# Altium project APP_1_huom2704.PrjPcb (part 2 of 2)

## Sheet APP_1_PowerAnalog.SchDoc
size Tabloid; SheetNumber: 15; SheetTotal: 16; Sheet_Name: Power; Size: 11x17
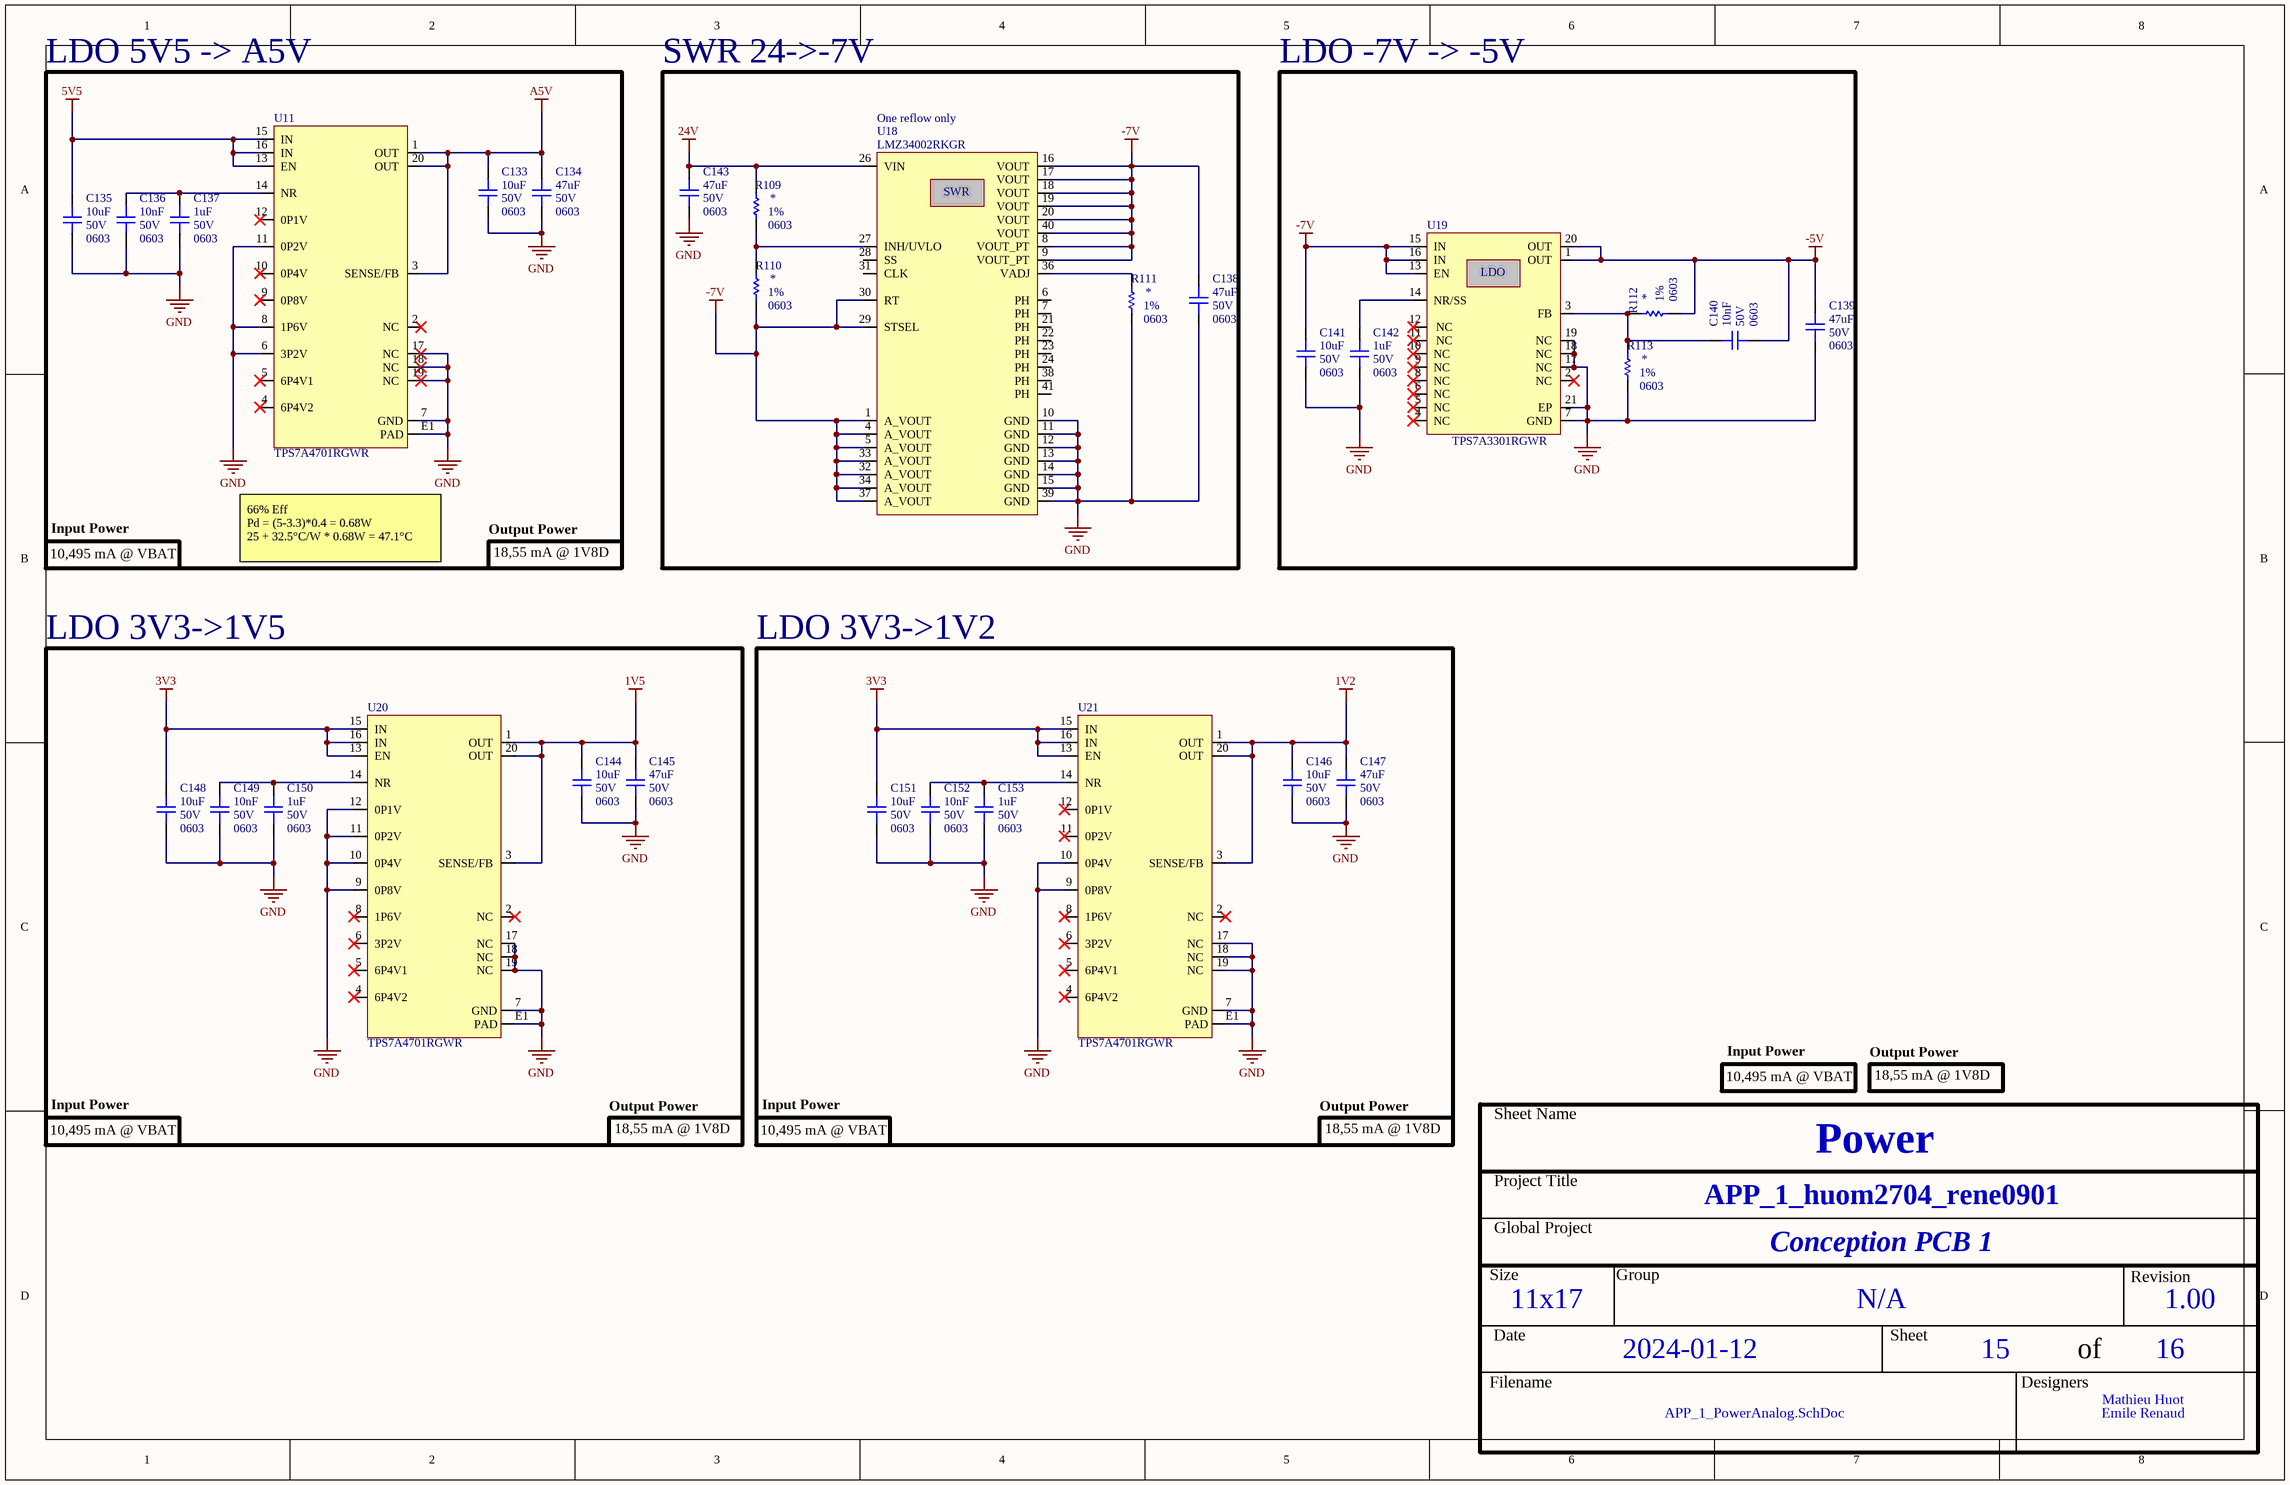
[diagram p7: APP_1_PowerAnalog.SchDoc]

### Parts
C133  value 10uF  Voltage: 50V  Package: 0603  [CAP_0603]  (hidden comment: CAP - 0603)
C134  value 47uF  Voltage: 50V  Package: 0603  [CAP_0603]  (hidden comment: CAP - 0603)
C135  value 10uF  Voltage: 50V  Package: 0603  [CAP_0603]  (hidden comment: CAP - 0603)
C136  value 10nF  Voltage: 50V  Package: 0603  [CAP_0603]  (hidden comment: CAP - 0603)
C137  value 1uF  Voltage: 50V  Package: 0603  [CAP_0603]  (hidden comment: CAP - 0603)
C138  value 47uF  Voltage: 50V  Package: 0603  [CAP_0603]  (hidden comment: CAP - 0603)
C139  value 47uF  Voltage: 50V  Package: 0603  [CAP_0603]  (hidden comment: CAP - 0603)
C140  value 10nF  Voltage: 50V  Package: 0603  [CAP_0603]  (hidden comment: CAP - 0603)
C141  value 10uF  Voltage: 50V  Package: 0603  [CAP_0603]  (hidden comment: CAP - 0603)
C142  value 1uF  Voltage: 50V  Package: 0603  [CAP_0603]  (hidden comment: CAP - 0603)
C143  value 47uF  Voltage: 50V  Package: 0603  [CAP_0603]  (hidden comment: CAP - 0603)
C144  value 10uF  Voltage: 50V  Package: 0603  [CAP_0603]  (hidden comment: CAP - 0603)
C145  value 47uF  Voltage: 50V  Package: 0603  [CAP_0603]  (hidden comment: CAP - 0603)
C146  value 10uF  Voltage: 50V  Package: 0603  [CAP_0603]  (hidden comment: CAP - 0603)
C147  value 47uF  Voltage: 50V  Package: 0603  [CAP_0603]  (hidden comment: CAP - 0603)
C148  value 10uF  Voltage: 50V  Package: 0603  [CAP_0603]  (hidden comment: CAP - 0603)
C149  value 10nF  Voltage: 50V  Package: 0603  [CAP_0603]  (hidden comment: CAP - 0603)
C150  value 1uF  Voltage: 50V  Package: 0603  [CAP_0603]  (hidden comment: CAP - 0603)
C151  value 10uF  Voltage: 50V  Package: 0603  [CAP_0603]  (hidden comment: CAP - 0603)
C152  value 10nF  Voltage: 50V  Package: 0603  [CAP_0603]  (hidden comment: CAP - 0603)
C153  value 1uF  Voltage: 50V  Package: 0603  [CAP_0603]  (hidden comment: CAP - 0603)
R109  Package: 0603  Precision: 1%  [RES_0603]  (hidden comment: RES - 0603)
R110  Package: 0603  Precision: 1%  [RES_0603]  (hidden comment: RES - 0603)
R111  Package: 0603  Precision: 1%  [RES_0603]  (hidden comment: RES - 0603)
R112  Package: 0603  Precision: 1%  [RES_0603]  (hidden comment: RES - 0603)
R113  Package: 0603  Precision: 1%  [RES_0603]  (hidden comment: RES - 0603)
U11  TPS7A4701RGWR  [REG_TPS7A4701RGWR]
U18  LMZ34002RKGR  Assembly Note: One reflow only  [REG_SWR_LMZ34002RKGR]
U19  TPS7A3301RGWR  [REG_LDO_TPS7A3301RGWR]
U20  TPS7A4701RGWR  [REG_TPS7A4701RGWR]
U21  TPS7A4701RGWR  [REG_TPS7A4701RGWR]

### Blocks framed on the sheet
LDO 5V5 -> A5V: C133-C137 U11
SWR 24->-7V: C138 C143 R109-R111 U18
LDO -7V -> -5V: C139-C142 R112 R113 U19
LDO 3V3->1V5: C144 C145 C148-C150 U20
LDO 3V3->1V2: C146 C147 C151-C153 U21

### Nets
1V2: C146.2 C147.2 U21.1(OUT) U21.3(SENSE/FB) U21.20(OUT)
1V5: C144.2 C145.2 U20.1(OUT) U20.3(SENSE/FB) U20.20(OUT)
3V3: C148.2 C151.2 U20.13(EN) U20.15(IN) U20.16(IN) U21.13(EN) U21.15(IN) U21.16(IN)
5V5: C135.2 U11.13(EN) U11.15(IN) U11.16(IN)
24V: C143.2 R109.2 U18.26(VIN)
-5V: C139.2 C140.1 R112.1 U19.1(OUT) U19.20(OUT)
-7V: C138.2 C141.2 R110.1 U18.1(A_VOUT) U18.4(A_VOUT) U18.5(A_VOUT) U18.8(VOUT_PT) U18.9(VOUT_PT) U18.16(VOUT) U18.17(VOUT) U18.18(VOUT) U18.19(VOUT) U18.20(VOUT) U18.29(STSEL) U18.30(RT) U18.32(A_VOUT) U18.33(A_VOUT) U18.34(A_VOUT) U18.37(A_VOUT) U18.40(VOUT) U19.13(EN) U19.15(IN) U19.16(IN)
A5V: C133.2 C134.2 U11.1(OUT) U11.3(SENSE/FB) U11.20(OUT)
GND: C133.1 C134.1 C135.1 C136.1 C137.1 C138.1 C139.1 C141.1 C142.1 C143.1 C144.1 C145.1 C146.1 C147.1 C148.1 C149.1 C150.1 C151.1 C152.1 C153.1 R111.1 R113.1 U11.6(3P2V) U11.7(GND) U11.8(1P6V) U11.11(0P2V) U11.17(NC) U11.18(NC) U11.19(NC) U11.E1(PAD) U18.10(GND) U18.11(GND) U18.12(GND) U18.13(GND) U18.14(GND) U18.15(GND) U18.39(GND) U19.7(GND) U19.17(NC) U19.18(NC) U19.19(NC) U19.21(EP) U20.7(GND) U20.9(0P8V) U20.10(0P4V) U20.11(0P2V) U20.12(0P1V) U20.17(NC) U20.18(NC) U20.19(NC) U20.E1(PAD) U21.7(GND) U21.9(0P8V) U21.10(0P4V) U21.17(NC) U21.18(NC) U21.19(NC) U21.E1(PAD)
NetC136_2: C136.2 C137.2 U11.14(NR)
NetC140_2: C140.2 R112.2 R113.2 U19.3(FB)
NetC142_2: C142.2 U19.14(NR/SS)
NetC149_2: C149.2 C150.2 U20.14(NR)
NetC152_2: C152.2 C153.2 U21.14(NR)
NetR109_1: R109.1 R110.2 U18.27(INH/UVLO)
NetR111_2: R111.2 U18.36(VADJ)

Not connected (* = marked no-connect by the designer): U11 2(NC)* 4(6P4V2)* 5(6P4V1)* 9(0P8V)* 10(0P4V)* 12(0P1V)*; U18 2(DNC) 3(DNC) 6(PH) 7(PH) 21(PH) 22(PH) 23(PH) 24(PH) 25(DNC) 28(SS) 31(CLK) 35(DNC) 38(PH) 41(PH); U19 2(NC)* 4(NC)* 5(NC)* 6(NC)* 8(NC)* 9(NC)* 10(NC)* 11(NC)* 12(NC)*; U20 2(NC)* 4(6P4V2)* 5(6P4V1)* 6(3P2V)* 8(1P6V)*; U21 2(NC)* 4(6P4V2)* 5(6P4V1)* 6(3P2V)* 8(1P6V)* 11(0P2V)* 12(0P1V)*

### Notes on the sheet
- 10,495 mA @ VBAT
- Input Power
- 66% Eff
  Pd = (5-3.3)*0.4 = 0.68W
  25 + 32.5°C/W * 0.68W = 47.1°C
- Output Power
- 18,55 mA @ 1V8D
- Sheet Name
- Project Title
- Global Project
- Size
- Group
- Revision
- Date
- Sheet
- of
- Filename
- Designers
- (in symbol REG_LDO_TPS7A3301RGWR) LDO
- (in symbol REG_SWR_LMZ34002RKGR) SWR

### Library data of the parts
C133-C153 = CAP - 0603: Precision: 10%; Current: *; CreatedBy: Jonathan Bouchard; Power: *
U11 U20 U21 = REG_LDO_TPS7A4701RGWR: REG - LINEAR POS ADJ 1A - 20VQFN; Manufacturer #1: Texas Instruments; GRAMS Lib Spec: 2.8; Magnetic Material: Unknown; Polarized: Yes; Value: 1.4 à 34V; Voltage rating: 35V max; Assembly Type: SMD; CreatedBy/Date: L-P Gauthier / 2018-05-29; Current Rating: 1A; Manufacturer #2: TBD; Part Number #1: TPS7A4701RGWR; Part Number #2: TBD; Package: 20-VQFN Exposed Pad; Power Max: *; Tolerance: -; Supplier 1: Digi-Key; Supplier Part Number 1: 296-37224-1-ND; VerifiedBy: Caroline Paulin - 28 sept 2018; Temperature: -40°C ~ 125°C; HelpURL: http://www.ti.com/lit/ds/symlink/tps7a47.pdf; Cryo: UNKNOWN
U18 = REG_SWR_LMZ34002RKGR: REG - DC DC Converter -3V to -17V 2A - 41-B1QFN; Manufacturer #1: Texas Instruments; Value: -3 ~ -17V; Voltage Rating: 4.5-40V; Power Max: 15W; GRAMS Lib Spec: 2.8c; Magnetic Material: Unknown; Polarized: Yes; Tolerance: *; Current Rating: 2A; HelpURL: http://www.ti.com/lit/ds/symlink/lmz34002.pdf; CreatedBy/Date: P.Marcoux  20-06-2019; VerifiedBy: C.Paulin - 22/01/2020; Temperature: -40°C ~ 85°C; Package: 41-B1QFN; Manufacturer #2: *; Note: *; Assembly Type: SMD; Part Number #2: *; Part Number #1: LMZ34002RKGR; Supplier 1: Digi-Key; Supplier Part Number 1: 296-44356-1-ND; Cryo: UNKNOWN
U19 = REG_LDO_TPS7A3301RGWR: REG - LDO Negative Adjustable 1 Output -1.18V-33V 1A -  20-VQFN (5x5); Manufacturer #1: Texas Instruments; Value: -1.18V~-33V; Voltage Rating: -36V; GRAMS Lib Spec: 2.8; Magnetic Material: Unknown; Polarized: Yes; Tolerance: *; Current Rating: 1A; Power Max: *; HelpURL: http://www.ti.com/lit/ds/symlink/tps7a33.pdf; CreatedBy/Date: Keven Deslandes - 2018/10/11; VerifiedBy: Caroline Paulin - 11/12/2018; Temperature: -40°C ~ 125°C; Package: 20-VQFN; Manufacturer #2: *; Assembly Type: SMD; Part Number #2: *; Part Number #1: TPS7A3301RGWR; Supplier 1: Digi-Key; Supplier Part Number 1: 296-39502-1-ND; Cryo: UNKNOWN
R109-R113 = RES - 0603: Current: *; CreatedBy: Jonathan Bouchard; Value: *

## Nets that join several sheets
1V5: APP_1_FPGA_m (10 pins), APP_1_PowerAnalog (5 pins)
1V8: APP_1_DAC_m (14 pins), APP_1_ADC_m (12 pins)
3V3: APP_1_Ethernet_m (5 pins), APP_1_FPGA_m (17 pins), APP_1_PLL_m (22 pins), APP_1_PowerAnalog (8 pins)
-5V: APP_1_DAC_m (C74.2 C97.2 U15.4), APP_1_ADC_m (U17.21 U17.22 U22.21 U22.22), APP_1_PowerAnalog (5 pins)
A3V3: APP_1_PLL_m (L3.2 U10.1 U10.47), APP_1_DAC_m (8 pins), APP_1_ADC_m (9 pins)
A5V: APP_1_DAC_m (C130.2 C131.2 U15.8), APP_1_ADC_m (12 pins), APP_1_PowerAnalog (5 pins)
GND: APP_1_Ethernet_m (16 pins), APP_1_FPGA_m (79 pins), APP_1_PLL_m (23 pins), APP_1_DAC_m (28 pins), APP_1_ADC_m (38 pins), APP_1_JTAG_m (6 pins), APP_1_PowerAnalog (58 pins)
200MHz_N: APP_1_PLL_m (U10.20), APP_1_DAC_m (U14.20)
200MHz_P: APP_1_PLL_m (U10.19), APP_1_DAC_m (U14.19)
400MHz_N: APP_1_PLL_m (U10.17), APP_1_DAC_m (U14.18)
400MHz_P: APP_1_PLL_m (U10.16), APP_1_DAC_m (U14.17)